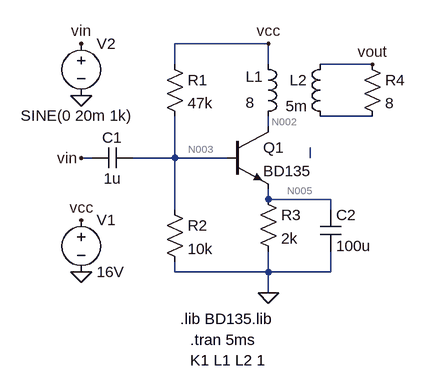
[diagram p0: schematic transformer_coupled_class_A.asc]
transformer_coupled_class_A.asc, the LTspice schematic file:
Version 4.1
SHEET 1 880 680
WIRE 208 0 64 0
WIRE 64 32 64 0
WIRE 208 32 208 0
WIRE 368 32 288 32
WIRE 368 112 288 112
WIRE 208 128 208 112
WIRE -64 176 -80 176
WIRE 64 176 64 112
WIRE 64 176 0 176
WIRE 144 176 64 176
WIRE 272 176 272 160
WIRE 208 240 208 224
WIRE 304 240 208 240
WIRE 64 256 64 176
WIRE 304 256 304 240
WIRE 64 352 64 336
WIRE 208 352 208 320
WIRE 208 352 64 352
WIRE 304 352 304 320
WIRE 304 352 208 352
WIRE 208 384 208 352
FLAG 368 32 vout
FLAG -80 176 vin
FLAG -80 352 0
FLAG -80 272 vcc
FLAG 208 0 vcc
FLAG -80 80 0
FLAG -80 0 vin
FLAG 208 384 0
SYMBOL ind 192 16 R0
WINDOW 0 -19 35 Left 2
WINDOW 3 -19 75 Left 2
SYMATTR InstName L1
SYMATTR Value 8
SYMATTR Type ind
SYMBOL res 48 16 R0
SYMATTR InstName R1
SYMATTR Value 47k
SYMBOL res 192 224 R0
SYMATTR InstName R3
SYMATTR Value 2k
SYMBOL npn 144 128 R0
SYMATTR InstName Q1
SYMATTR Value BD135
SYMBOL cap 0 160 R90
WINDOW 0 0 32 VBottom 2
WINDOW 3 32 32 VTop 2
SYMATTR InstName C1
SYMATTR Value 1u
SYMBOL ind 304 16 M0
SYMATTR InstName L2
SYMATTR Value 5m
SYMATTR Type ind
SYMBOL res 352 16 R0
SYMATTR InstName R4
SYMATTR Value 8
SYMBOL voltage -80 256 R0
WINDOW 123 0 0 Left 0
WINDOW 39 0 0 Left 0
SYMATTR InstName V1
SYMATTR Value 16V
SYMBOL voltage -80 -16 R0
WINDOW 3 -93 127 Left 2
WINDOW 123 0 0 Left 0
WINDOW 39 0 0 Left 0
SYMATTR InstName V2
SYMATTR Value SINE(0 20m 1k)
SYMBOL cap 288 256 R0
SYMATTR InstName C2
SYMATTR Value 100u
SYMBOL res 48 240 R0
SYMATTR InstName R2
SYMATTR Value 10k
TEXT 72 424 Left 2 !.lib BD135.lib
TEXT 88 456 Left 2 !.tran 5ms
TEXT 88 488 Left 2 !K1 L1 L2 1

The netlist it stands for:
* transformer_coupled_class_A.asc
L1 vcc N002 8
R1 vcc N003 47k
R3 N005 0 2k
Q1 N002 N003 N005 0 BD135
C1 N003 vin 1u
L2 vout N001 5m
R4 vout N001 8
V1 vcc 0 16V
V2 vin 0 SINE(0 20m 1k)
C2 N005 0 100u
R2 N003 0 10k
.model NPN NPN
.model PNP PNP
.lib standard.bjt
.lib BD135.lib
.tran 5ms
K1 L1 L2 1
.backanno
.end

* Results of the author's LTspice run, read from the files saved beside the schematic
* Operating Point, zero values left out:
*   V(n002) = 16 V
*   V(n005) = 2.132 V
*   V(vcc) = 16 V
*   V(n003) = 2.75 V
*   I(R3) = 1.066 mA
*   I(V1) = -1.341 mA
*   I(R2) = 275 µA
*   I(L1) = 1.059 mA
*   Ic(Q1) = 1.059 mA
*   Ib(Q1) = 6.915 µA
*   Ie(Q1) = -1.066 mA
*   I(R1) = 281.9 µA
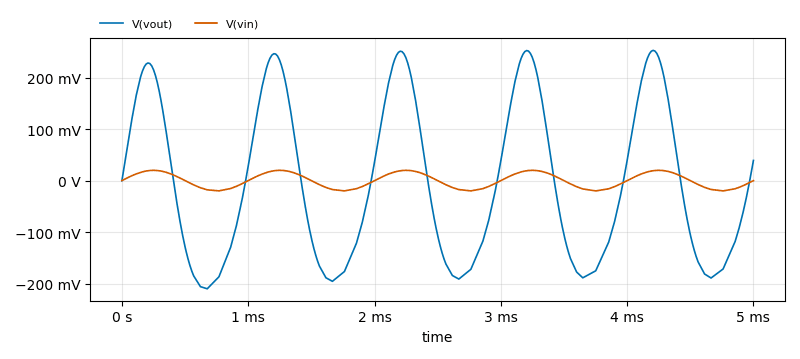
[diagram p1: Transient Analysis of transformer_coupled_class_A.asc, plotted from the saved traces]
* Transient Analysis, 1 run:
*   V(vout): min -210 mV, max 252.9 mV, average -5.833 mV, rms 154.9 mV, last 39.17 mV
*   V(vin): min -19.98 mV, max 20 mV, average 119.8 µV, rms 14.02 mV, last 0 V